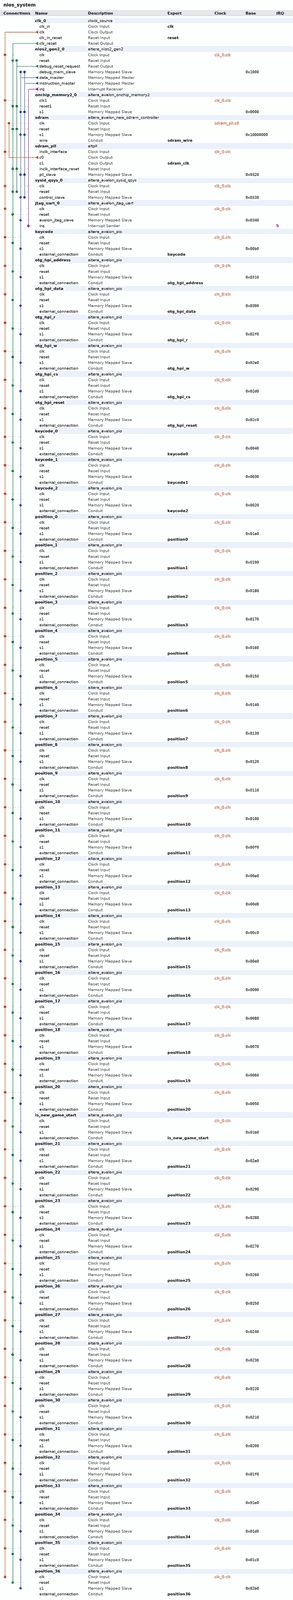
[diagram p0: system contents, whole]
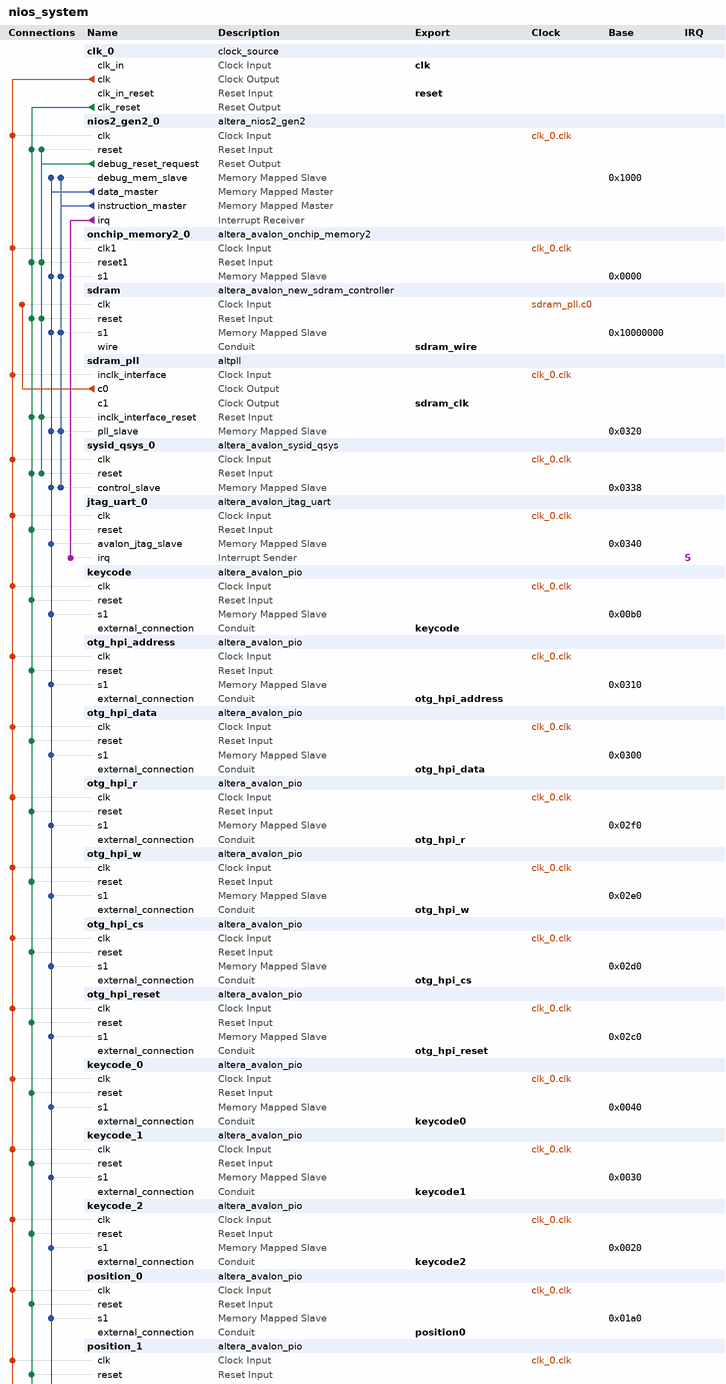
[diagram p1: system contents, upper part]
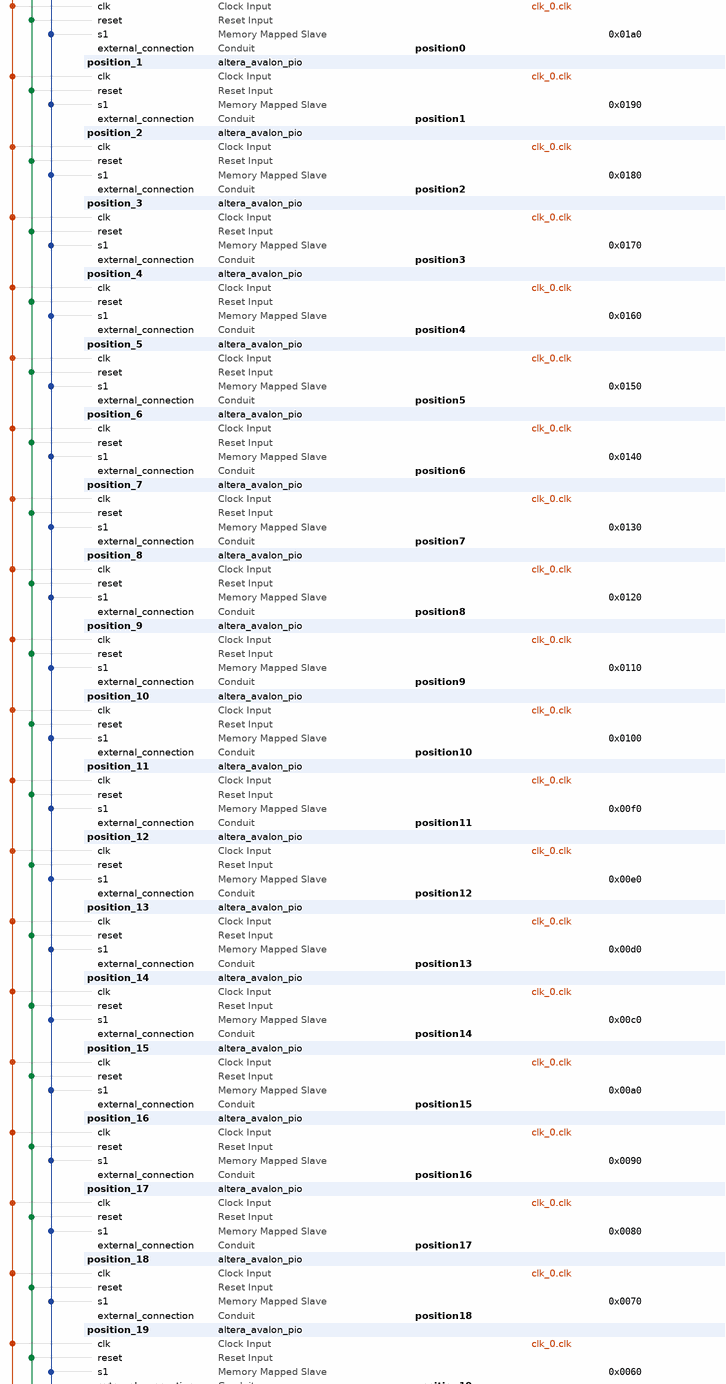
[diagram p2: system contents, middle part]
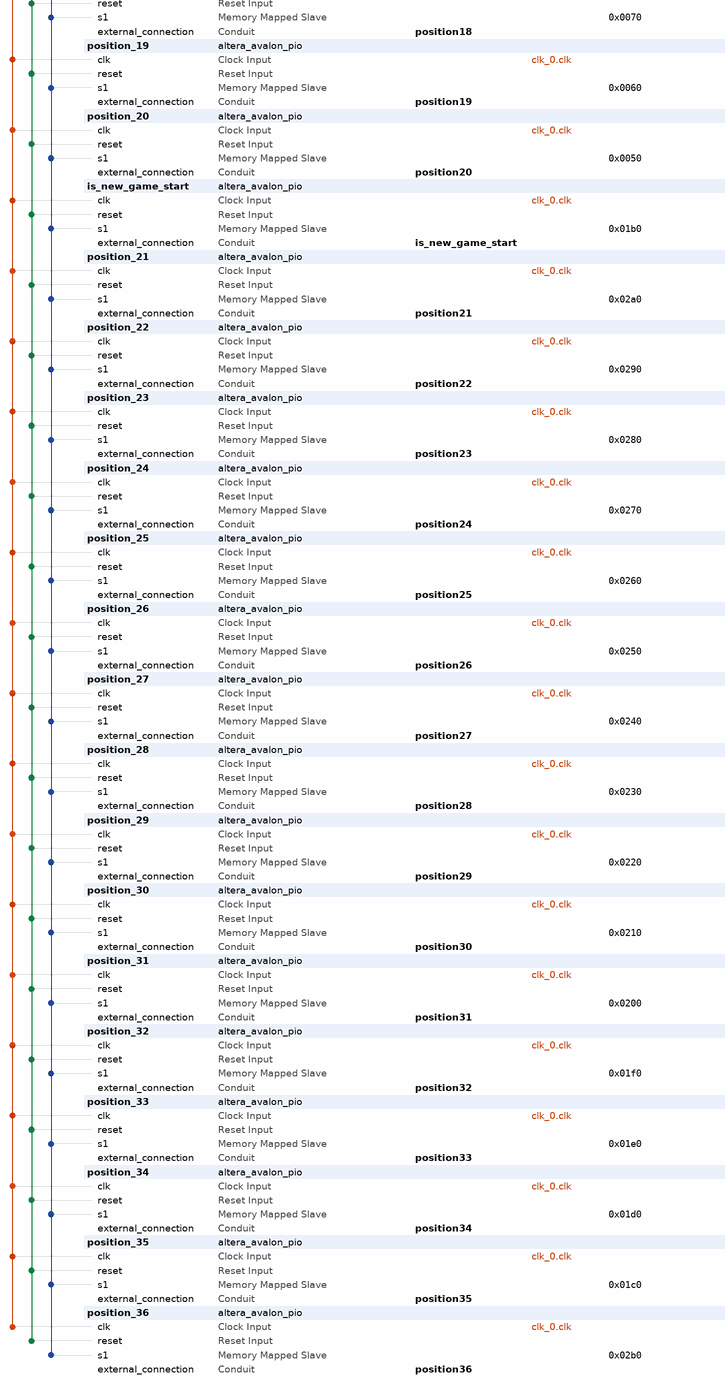
[diagram p3: system contents, lower part]
# Platform Designer (Qsys) system nios_system, Cyclone IV E EP4CE115F29C7
# Parameters at their usual value, and those the tool derives, are not listed.
package require -exact qsys 18.0
create_system nios_system
set_project_property DEVICE_FAMILY {Cyclone IV E}
set_project_property DEVICE EP4CE115F29C7

add_instance clk_0 clock_source 18.0
set_instance_parameter_value clk_0 clockFrequency 50000000

add_instance nios2_gen2_0 altera_nios2_gen2 18.0
set_instance_parameter_value nios2_gen2_0 dcache_size 2048
set_instance_parameter_value nios2_gen2_0 exceptionSlave sdram.s1
set_instance_parameter_value nios2_gen2_0 icache_size 4096
set_instance_parameter_value nios2_gen2_0 impl Tiny
set_instance_parameter_value nios2_gen2_0 resetSlave sdram.s1

add_instance onchip_memory2_0 altera_avalon_onchip_memory2 18.0
set_instance_parameter_value onchip_memory2_0 dataWidth 32
set_instance_parameter_value onchip_memory2_0 dualPort false
set_instance_parameter_value onchip_memory2_0 initMemContent true
set_instance_parameter_value onchip_memory2_0 initializationFileName onchip_mem.hex
set_instance_parameter_value onchip_memory2_0 memorySize 16

add_instance sdram altera_avalon_new_sdram_controller 18.0
set_instance_parameter_value sdram TAC 5.5
set_instance_parameter_value sdram TRCD 20.0
set_instance_parameter_value sdram TRP 20.0
set_instance_parameter_value sdram casLatency 3
set_instance_parameter_value sdram columnWidth 10
set_instance_parameter_value sdram dataWidth 32
set_instance_parameter_value sdram generateSimulationModel false
set_instance_parameter_value sdram model single_Micron_MT48LC4M32B2_7_chip
set_instance_parameter_value sdram numberOfBanks 4
set_instance_parameter_value sdram numberOfChipSelects 1
set_instance_parameter_value sdram powerUpDelay 200.0
set_instance_parameter_value sdram refreshPeriod 7.8125
set_instance_parameter_value sdram rowWidth 13

add_instance sdram_pll altpll 18.0
set_instance_parameter_value sdram_pll CLK0_DIVIDE_BY 1
set_instance_parameter_value sdram_pll CLK0_MULTIPLY_BY 1
set_instance_parameter_value sdram_pll CLK1_DIVIDE_BY 1
set_instance_parameter_value sdram_pll CLK1_DUTY_CYCLE 50
set_instance_parameter_value sdram_pll CLK1_MULTIPLY_BY 1
set_instance_parameter_value sdram_pll CLK1_PHASE_SHIFT -3000
set_instance_parameter_value sdram_pll INCLK0_INPUT_FREQUENCY 20000
set_instance_parameter_value sdram_pll PORT_ARESET PORT_UNUSED
set_instance_parameter_value sdram_pll PORT_LOCKED PORT_UNUSED
set_instance_parameter_value sdram_pll PORT_clk1 PORT_USED
set_instance_parameter_value sdram_pll PORT_clk2 PORT_UNUSED
set_instance_parameter_value sdram_pll PORT_clk3 PORT_UNUSED

add_instance sysid_qsys_0 altera_avalon_sysid_qsys 18.0
set_instance_parameter_value sysid_qsys_0 id 0

add_instance jtag_uart_0 altera_avalon_jtag_uart 18.0
set_instance_parameter_value jtag_uart_0 simInteractiveOptions NO_INTERACTIVE_WINDOWS

add_instance keycode altera_avalon_pio 18.0
set_instance_parameter_value keycode direction Output
set_instance_parameter_value keycode width 32

add_instance otg_hpi_address altera_avalon_pio 18.0
set_instance_parameter_value otg_hpi_address direction Output
set_instance_parameter_value otg_hpi_address width 2

add_instance otg_hpi_data altera_avalon_pio 18.0
set_instance_parameter_value otg_hpi_data direction InOut
set_instance_parameter_value otg_hpi_data width 16

add_instance otg_hpi_r altera_avalon_pio 18.0
set_instance_parameter_value otg_hpi_r direction Output
set_instance_parameter_value otg_hpi_r width 1

add_instance otg_hpi_w altera_avalon_pio 18.0
set_instance_parameter_value otg_hpi_w direction Output
set_instance_parameter_value otg_hpi_w width 1

add_instance otg_hpi_cs altera_avalon_pio 18.0
set_instance_parameter_value otg_hpi_cs direction Output
set_instance_parameter_value otg_hpi_cs width 1

add_instance otg_hpi_reset altera_avalon_pio 18.0
set_instance_parameter_value otg_hpi_reset direction Output
set_instance_parameter_value otg_hpi_reset width 1

add_instance keycode_0 altera_avalon_pio 18.0
set_instance_parameter_value keycode_0 direction Output
set_instance_parameter_value keycode_0 width 32

add_instance keycode_1 altera_avalon_pio 18.0
set_instance_parameter_value keycode_1 direction Output
set_instance_parameter_value keycode_1 width 32

add_instance keycode_2 altera_avalon_pio 18.0
set_instance_parameter_value keycode_2 direction Output
set_instance_parameter_value keycode_2 width 32

add_instance position_0 altera_avalon_pio 18.0
set_instance_parameter_value position_0 direction Output
set_instance_parameter_value position_0 width 32

add_instance position_1 altera_avalon_pio 18.0
set_instance_parameter_value position_1 direction Output
set_instance_parameter_value position_1 width 32

add_instance position_2 altera_avalon_pio 18.0
set_instance_parameter_value position_2 direction Output
set_instance_parameter_value position_2 width 32

add_instance position_3 altera_avalon_pio 18.0
set_instance_parameter_value position_3 direction Output
set_instance_parameter_value position_3 width 32

add_instance position_4 altera_avalon_pio 18.0
set_instance_parameter_value position_4 direction Output
set_instance_parameter_value position_4 width 32

add_instance position_5 altera_avalon_pio 18.0
set_instance_parameter_value position_5 direction Output
set_instance_parameter_value position_5 width 32

add_instance position_6 altera_avalon_pio 18.0
set_instance_parameter_value position_6 direction Output
set_instance_parameter_value position_6 width 32

add_instance position_7 altera_avalon_pio 18.0
set_instance_parameter_value position_7 direction Output
set_instance_parameter_value position_7 width 32

add_instance position_8 altera_avalon_pio 18.0
set_instance_parameter_value position_8 direction Output
set_instance_parameter_value position_8 width 32

add_instance position_9 altera_avalon_pio 18.0
set_instance_parameter_value position_9 direction Output
set_instance_parameter_value position_9 width 32

add_instance position_10 altera_avalon_pio 18.0
set_instance_parameter_value position_10 direction Output
set_instance_parameter_value position_10 width 32

add_instance position_11 altera_avalon_pio 18.0
set_instance_parameter_value position_11 direction Output
set_instance_parameter_value position_11 width 32

add_instance position_12 altera_avalon_pio 18.0
set_instance_parameter_value position_12 direction Output
set_instance_parameter_value position_12 width 32

add_instance position_13 altera_avalon_pio 18.0
set_instance_parameter_value position_13 direction Output
set_instance_parameter_value position_13 width 32

add_instance position_14 altera_avalon_pio 18.0
set_instance_parameter_value position_14 direction Output
set_instance_parameter_value position_14 width 32

add_instance position_15 altera_avalon_pio 18.0
set_instance_parameter_value position_15 direction Output
set_instance_parameter_value position_15 width 32

add_instance position_16 altera_avalon_pio 18.0
set_instance_parameter_value position_16 direction Output
set_instance_parameter_value position_16 width 32

add_instance position_17 altera_avalon_pio 18.0
set_instance_parameter_value position_17 direction Output
set_instance_parameter_value position_17 width 32

add_instance position_18 altera_avalon_pio 18.0
set_instance_parameter_value position_18 direction Output
set_instance_parameter_value position_18 width 32

add_instance position_19 altera_avalon_pio 18.0
set_instance_parameter_value position_19 direction Output
set_instance_parameter_value position_19 width 32

add_instance position_20 altera_avalon_pio 18.0
set_instance_parameter_value position_20 direction Output
set_instance_parameter_value position_20 width 32

add_instance is_new_game_start altera_avalon_pio 18.0
set_instance_parameter_value is_new_game_start direction Input
set_instance_parameter_value is_new_game_start width 32

add_instance position_21 altera_avalon_pio 18.0
set_instance_parameter_value position_21 direction Output
set_instance_parameter_value position_21 width 32

add_instance position_22 altera_avalon_pio 18.0
set_instance_parameter_value position_22 direction Output
set_instance_parameter_value position_22 width 32

add_instance position_23 altera_avalon_pio 18.0
set_instance_parameter_value position_23 direction Output
set_instance_parameter_value position_23 width 32

add_instance position_24 altera_avalon_pio 18.0
set_instance_parameter_value position_24 direction Output
set_instance_parameter_value position_24 width 32

add_instance position_25 altera_avalon_pio 18.0
set_instance_parameter_value position_25 direction Output
set_instance_parameter_value position_25 width 32

add_instance position_26 altera_avalon_pio 18.0
set_instance_parameter_value position_26 direction Output
set_instance_parameter_value position_26 width 32

add_instance position_27 altera_avalon_pio 18.0
set_instance_parameter_value position_27 direction Output
set_instance_parameter_value position_27 width 32

add_instance position_28 altera_avalon_pio 18.0
set_instance_parameter_value position_28 direction Output
set_instance_parameter_value position_28 width 32

add_instance position_29 altera_avalon_pio 18.0
set_instance_parameter_value position_29 direction Output
set_instance_parameter_value position_29 width 32

add_instance position_30 altera_avalon_pio 18.0
set_instance_parameter_value position_30 direction Output
set_instance_parameter_value position_30 width 32

add_instance position_31 altera_avalon_pio 18.0
set_instance_parameter_value position_31 direction Output
set_instance_parameter_value position_31 width 32

add_instance position_32 altera_avalon_pio 18.0
set_instance_parameter_value position_32 direction Output
set_instance_parameter_value position_32 width 32

add_instance position_33 altera_avalon_pio 18.0
set_instance_parameter_value position_33 direction Output
set_instance_parameter_value position_33 width 32

add_instance position_34 altera_avalon_pio 18.0
set_instance_parameter_value position_34 direction Output
set_instance_parameter_value position_34 width 32

add_instance position_35 altera_avalon_pio 18.0
set_instance_parameter_value position_35 direction Output
set_instance_parameter_value position_35 width 32

add_instance position_36 altera_avalon_pio 18.0
set_instance_parameter_value position_36 direction Output
set_instance_parameter_value position_36 width 32

# connections
add_connection clk_0.clk is_new_game_start.clk clock
add_connection clk_0.clk jtag_uart_0.clk clock
add_connection clk_0.clk keycode.clk clock
add_connection clk_0.clk keycode_0.clk clock
add_connection clk_0.clk keycode_1.clk clock
add_connection clk_0.clk keycode_2.clk clock
add_connection clk_0.clk nios2_gen2_0.clk clock
add_connection clk_0.clk onchip_memory2_0.clk1 clock
add_connection clk_0.clk otg_hpi_address.clk clock
add_connection clk_0.clk otg_hpi_cs.clk clock
add_connection clk_0.clk otg_hpi_data.clk clock
add_connection clk_0.clk otg_hpi_r.clk clock
add_connection clk_0.clk otg_hpi_reset.clk clock
add_connection clk_0.clk otg_hpi_w.clk clock
add_connection clk_0.clk position_0.clk clock
add_connection clk_0.clk position_1.clk clock
add_connection clk_0.clk position_2.clk clock
add_connection clk_0.clk position_3.clk clock
add_connection clk_0.clk position_4.clk clock
add_connection clk_0.clk position_5.clk clock
add_connection clk_0.clk position_6.clk clock
add_connection clk_0.clk position_7.clk clock
add_connection clk_0.clk position_8.clk clock
add_connection clk_0.clk position_9.clk clock
add_connection clk_0.clk position_10.clk clock
add_connection clk_0.clk position_11.clk clock
add_connection clk_0.clk position_12.clk clock
add_connection clk_0.clk position_13.clk clock
add_connection clk_0.clk position_14.clk clock
add_connection clk_0.clk position_15.clk clock
add_connection clk_0.clk position_16.clk clock
add_connection clk_0.clk position_17.clk clock
add_connection clk_0.clk position_18.clk clock
add_connection clk_0.clk position_19.clk clock
add_connection clk_0.clk position_20.clk clock
add_connection clk_0.clk position_21.clk clock
add_connection clk_0.clk position_22.clk clock
add_connection clk_0.clk position_23.clk clock
add_connection clk_0.clk position_24.clk clock
add_connection clk_0.clk position_25.clk clock
add_connection clk_0.clk position_26.clk clock
add_connection clk_0.clk position_27.clk clock
add_connection clk_0.clk position_28.clk clock
add_connection clk_0.clk position_29.clk clock
add_connection clk_0.clk position_30.clk clock
add_connection clk_0.clk position_31.clk clock
add_connection clk_0.clk position_32.clk clock
add_connection clk_0.clk position_33.clk clock
add_connection clk_0.clk position_34.clk clock
add_connection clk_0.clk position_35.clk clock
add_connection clk_0.clk position_36.clk clock
add_connection clk_0.clk sdram_pll.inclk_interface clock
add_connection clk_0.clk sysid_qsys_0.clk clock
add_connection sdram_pll.c0 sdram.clk clock
add_connection clk_0.clk_reset is_new_game_start.reset reset
add_connection clk_0.clk_reset jtag_uart_0.reset reset
add_connection clk_0.clk_reset keycode.reset reset
add_connection clk_0.clk_reset keycode_0.reset reset
add_connection clk_0.clk_reset keycode_1.reset reset
add_connection clk_0.clk_reset keycode_2.reset reset
add_connection clk_0.clk_reset nios2_gen2_0.reset reset
add_connection clk_0.clk_reset onchip_memory2_0.reset1 reset
add_connection clk_0.clk_reset otg_hpi_address.reset reset
add_connection clk_0.clk_reset otg_hpi_cs.reset reset
add_connection clk_0.clk_reset otg_hpi_data.reset reset
add_connection clk_0.clk_reset otg_hpi_r.reset reset
add_connection clk_0.clk_reset otg_hpi_reset.reset reset
add_connection clk_0.clk_reset otg_hpi_w.reset reset
add_connection clk_0.clk_reset position_0.reset reset
add_connection clk_0.clk_reset position_1.reset reset
add_connection clk_0.clk_reset position_2.reset reset
add_connection clk_0.clk_reset position_3.reset reset
add_connection clk_0.clk_reset position_4.reset reset
add_connection clk_0.clk_reset position_5.reset reset
add_connection clk_0.clk_reset position_6.reset reset
add_connection clk_0.clk_reset position_7.reset reset
add_connection clk_0.clk_reset position_8.reset reset
add_connection clk_0.clk_reset position_9.reset reset
add_connection clk_0.clk_reset position_10.reset reset
add_connection clk_0.clk_reset position_11.reset reset
add_connection clk_0.clk_reset position_12.reset reset
add_connection clk_0.clk_reset position_13.reset reset
add_connection clk_0.clk_reset position_14.reset reset
add_connection clk_0.clk_reset position_15.reset reset
add_connection clk_0.clk_reset position_16.reset reset
add_connection clk_0.clk_reset position_17.reset reset
add_connection clk_0.clk_reset position_18.reset reset
add_connection clk_0.clk_reset position_19.reset reset
add_connection clk_0.clk_reset position_20.reset reset
add_connection clk_0.clk_reset position_21.reset reset
add_connection clk_0.clk_reset position_22.reset reset
add_connection clk_0.clk_reset position_23.reset reset
add_connection clk_0.clk_reset position_24.reset reset
add_connection clk_0.clk_reset position_25.reset reset
add_connection clk_0.clk_reset position_26.reset reset
add_connection clk_0.clk_reset position_27.reset reset
add_connection clk_0.clk_reset position_28.reset reset
add_connection clk_0.clk_reset position_29.reset reset
add_connection clk_0.clk_reset position_30.reset reset
add_connection clk_0.clk_reset position_31.reset reset
add_connection clk_0.clk_reset position_32.reset reset
add_connection clk_0.clk_reset position_33.reset reset
add_connection clk_0.clk_reset position_34.reset reset
add_connection clk_0.clk_reset position_35.reset reset
add_connection clk_0.clk_reset position_36.reset reset
add_connection clk_0.clk_reset sdram.reset reset
add_connection clk_0.clk_reset sdram_pll.inclk_interface_reset reset
add_connection clk_0.clk_reset sysid_qsys_0.reset reset
add_connection nios2_gen2_0.debug_reset_request nios2_gen2_0.reset reset
add_connection nios2_gen2_0.debug_reset_request onchip_memory2_0.reset1 reset
add_connection nios2_gen2_0.debug_reset_request sdram.reset reset
add_connection nios2_gen2_0.debug_reset_request sdram_pll.inclk_interface_reset reset
add_connection nios2_gen2_0.debug_reset_request sysid_qsys_0.reset reset
add_connection nios2_gen2_0.data_master is_new_game_start.s1 avalon
set_connection_parameter_value nios2_gen2_0.data_master/is_new_game_start.s1 baseAddress 0x01b0
add_connection nios2_gen2_0.data_master jtag_uart_0.avalon_jtag_slave avalon
set_connection_parameter_value nios2_gen2_0.data_master/jtag_uart_0.avalon_jtag_slave baseAddress 0x0340
add_connection nios2_gen2_0.data_master keycode.s1 avalon
set_connection_parameter_value nios2_gen2_0.data_master/keycode.s1 baseAddress 0x00b0
add_connection nios2_gen2_0.data_master keycode_0.s1 avalon
set_connection_parameter_value nios2_gen2_0.data_master/keycode_0.s1 baseAddress 0x0040
add_connection nios2_gen2_0.data_master keycode_1.s1 avalon
set_connection_parameter_value nios2_gen2_0.data_master/keycode_1.s1 baseAddress 0x0030
add_connection nios2_gen2_0.data_master keycode_2.s1 avalon
set_connection_parameter_value nios2_gen2_0.data_master/keycode_2.s1 baseAddress 0x0020
add_connection nios2_gen2_0.data_master nios2_gen2_0.debug_mem_slave avalon
set_connection_parameter_value nios2_gen2_0.data_master/nios2_gen2_0.debug_mem_slave baseAddress 0x1000
add_connection nios2_gen2_0.data_master onchip_memory2_0.s1 avalon
set_connection_parameter_value nios2_gen2_0.data_master/onchip_memory2_0.s1 baseAddress 0x0000
add_connection nios2_gen2_0.data_master otg_hpi_address.s1 avalon
set_connection_parameter_value nios2_gen2_0.data_master/otg_hpi_address.s1 baseAddress 0x0310
add_connection nios2_gen2_0.data_master otg_hpi_cs.s1 avalon
set_connection_parameter_value nios2_gen2_0.data_master/otg_hpi_cs.s1 baseAddress 0x02d0
add_connection nios2_gen2_0.data_master otg_hpi_data.s1 avalon
set_connection_parameter_value nios2_gen2_0.data_master/otg_hpi_data.s1 baseAddress 0x0300
add_connection nios2_gen2_0.data_master otg_hpi_r.s1 avalon
set_connection_parameter_value nios2_gen2_0.data_master/otg_hpi_r.s1 baseAddress 0x02f0
add_connection nios2_gen2_0.data_master otg_hpi_reset.s1 avalon
set_connection_parameter_value nios2_gen2_0.data_master/otg_hpi_reset.s1 baseAddress 0x02c0
add_connection nios2_gen2_0.data_master otg_hpi_w.s1 avalon
set_connection_parameter_value nios2_gen2_0.data_master/otg_hpi_w.s1 baseAddress 0x02e0
add_connection nios2_gen2_0.data_master position_0.s1 avalon
set_connection_parameter_value nios2_gen2_0.data_master/position_0.s1 baseAddress 0x01a0
add_connection nios2_gen2_0.data_master position_1.s1 avalon
set_connection_parameter_value nios2_gen2_0.data_master/position_1.s1 baseAddress 0x0190
add_connection nios2_gen2_0.data_master position_2.s1 avalon
set_connection_parameter_value nios2_gen2_0.data_master/position_2.s1 baseAddress 0x0180
add_connection nios2_gen2_0.data_master position_3.s1 avalon
set_connection_parameter_value nios2_gen2_0.data_master/position_3.s1 baseAddress 0x0170
add_connection nios2_gen2_0.data_master position_4.s1 avalon
set_connection_parameter_value nios2_gen2_0.data_master/position_4.s1 baseAddress 0x0160
add_connection nios2_gen2_0.data_master position_5.s1 avalon
set_connection_parameter_value nios2_gen2_0.data_master/position_5.s1 baseAddress 0x0150
add_connection nios2_gen2_0.data_master position_6.s1 avalon
set_connection_parameter_value nios2_gen2_0.data_master/position_6.s1 baseAddress 0x0140
add_connection nios2_gen2_0.data_master position_7.s1 avalon
set_connection_parameter_value nios2_gen2_0.data_master/position_7.s1 baseAddress 0x0130
add_connection nios2_gen2_0.data_master position_8.s1 avalon
set_connection_parameter_value nios2_gen2_0.data_master/position_8.s1 baseAddress 0x0120
add_connection nios2_gen2_0.data_master position_9.s1 avalon
set_connection_parameter_value nios2_gen2_0.data_master/position_9.s1 baseAddress 0x0110
add_connection nios2_gen2_0.data_master position_10.s1 avalon
set_connection_parameter_value nios2_gen2_0.data_master/position_10.s1 baseAddress 0x0100
add_connection nios2_gen2_0.data_master position_11.s1 avalon
set_connection_parameter_value nios2_gen2_0.data_master/position_11.s1 baseAddress 0x00f0
add_connection nios2_gen2_0.data_master position_12.s1 avalon
set_connection_parameter_value nios2_gen2_0.data_master/position_12.s1 baseAddress 0x00e0
add_connection nios2_gen2_0.data_master position_13.s1 avalon
set_connection_parameter_value nios2_gen2_0.data_master/position_13.s1 baseAddress 0x00d0
add_connection nios2_gen2_0.data_master position_14.s1 avalon
set_connection_parameter_value nios2_gen2_0.data_master/position_14.s1 baseAddress 0x00c0
add_connection nios2_gen2_0.data_master position_15.s1 avalon
set_connection_parameter_value nios2_gen2_0.data_master/position_15.s1 baseAddress 0x00a0
add_connection nios2_gen2_0.data_master position_16.s1 avalon
set_connection_parameter_value nios2_gen2_0.data_master/position_16.s1 baseAddress 0x0090
add_connection nios2_gen2_0.data_master position_17.s1 avalon
set_connection_parameter_value nios2_gen2_0.data_master/position_17.s1 baseAddress 0x0080
add_connection nios2_gen2_0.data_master position_18.s1 avalon
set_connection_parameter_value nios2_gen2_0.data_master/position_18.s1 baseAddress 0x0070
add_connection nios2_gen2_0.data_master position_19.s1 avalon
set_connection_parameter_value nios2_gen2_0.data_master/position_19.s1 baseAddress 0x0060
add_connection nios2_gen2_0.data_master position_20.s1 avalon
set_connection_parameter_value nios2_gen2_0.data_master/position_20.s1 baseAddress 0x0050
add_connection nios2_gen2_0.data_master position_21.s1 avalon
set_connection_parameter_value nios2_gen2_0.data_master/position_21.s1 baseAddress 0x02a0
add_connection nios2_gen2_0.data_master position_22.s1 avalon
set_connection_parameter_value nios2_gen2_0.data_master/position_22.s1 baseAddress 0x0290
add_connection nios2_gen2_0.data_master position_23.s1 avalon
set_connection_parameter_value nios2_gen2_0.data_master/position_23.s1 baseAddress 0x0280
add_connection nios2_gen2_0.data_master position_24.s1 avalon
set_connection_parameter_value nios2_gen2_0.data_master/position_24.s1 baseAddress 0x0270
add_connection nios2_gen2_0.data_master position_25.s1 avalon
set_connection_parameter_value nios2_gen2_0.data_master/position_25.s1 baseAddress 0x0260
add_connection nios2_gen2_0.data_master position_26.s1 avalon
set_connection_parameter_value nios2_gen2_0.data_master/position_26.s1 baseAddress 0x0250
add_connection nios2_gen2_0.data_master position_27.s1 avalon
set_connection_parameter_value nios2_gen2_0.data_master/position_27.s1 baseAddress 0x0240
add_connection nios2_gen2_0.data_master position_28.s1 avalon
set_connection_parameter_value nios2_gen2_0.data_master/position_28.s1 baseAddress 0x0230
add_connection nios2_gen2_0.data_master position_29.s1 avalon
set_connection_parameter_value nios2_gen2_0.data_master/position_29.s1 baseAddress 0x0220
add_connection nios2_gen2_0.data_master position_30.s1 avalon
set_connection_parameter_value nios2_gen2_0.data_master/position_30.s1 baseAddress 0x0210
add_connection nios2_gen2_0.data_master position_31.s1 avalon
set_connection_parameter_value nios2_gen2_0.data_master/position_31.s1 baseAddress 0x0200
add_connection nios2_gen2_0.data_master position_32.s1 avalon
set_connection_parameter_value nios2_gen2_0.data_master/position_32.s1 baseAddress 0x01f0
add_connection nios2_gen2_0.data_master position_33.s1 avalon
set_connection_parameter_value nios2_gen2_0.data_master/position_33.s1 baseAddress 0x01e0
add_connection nios2_gen2_0.data_master position_34.s1 avalon
set_connection_parameter_value nios2_gen2_0.data_master/position_34.s1 baseAddress 0x01d0
add_connection nios2_gen2_0.data_master position_35.s1 avalon
set_connection_parameter_value nios2_gen2_0.data_master/position_35.s1 baseAddress 0x01c0
add_connection nios2_gen2_0.data_master position_36.s1 avalon
set_connection_parameter_value nios2_gen2_0.data_master/position_36.s1 baseAddress 0x02b0
add_connection nios2_gen2_0.data_master sdram.s1 avalon
set_connection_parameter_value nios2_gen2_0.data_master/sdram.s1 baseAddress 0x10000000
add_connection nios2_gen2_0.data_master sdram_pll.pll_slave avalon
set_connection_parameter_value nios2_gen2_0.data_master/sdram_pll.pll_slave baseAddress 0x0320
add_connection nios2_gen2_0.data_master sysid_qsys_0.control_slave avalon
set_connection_parameter_value nios2_gen2_0.data_master/sysid_qsys_0.control_slave baseAddress 0x0338
add_connection nios2_gen2_0.instruction_master nios2_gen2_0.debug_mem_slave avalon
set_connection_parameter_value nios2_gen2_0.instruction_master/nios2_gen2_0.debug_mem_slave baseAddress 0x1000
add_connection nios2_gen2_0.instruction_master onchip_memory2_0.s1 avalon
set_connection_parameter_value nios2_gen2_0.instruction_master/onchip_memory2_0.s1 baseAddress 0x0000
add_connection nios2_gen2_0.instruction_master sdram.s1 avalon
set_connection_parameter_value nios2_gen2_0.instruction_master/sdram.s1 baseAddress 0x10000000
add_connection nios2_gen2_0.instruction_master sdram_pll.pll_slave avalon
set_connection_parameter_value nios2_gen2_0.instruction_master/sdram_pll.pll_slave baseAddress 0x0320
add_connection nios2_gen2_0.instruction_master sysid_qsys_0.control_slave avalon
set_connection_parameter_value nios2_gen2_0.instruction_master/sysid_qsys_0.control_slave baseAddress 0x0338
add_connection nios2_gen2_0.irq jtag_uart_0.irq interrupt
set_connection_parameter_value nios2_gen2_0.irq/jtag_uart_0.irq irqNumber 5

# exported interfaces
add_interface clk clock sink
set_interface_property clk EXPORT_OF clk_0.clk_in
add_interface is_new_game_start conduit end
set_interface_property is_new_game_start EXPORT_OF is_new_game_start.external_connection
add_interface keycode conduit end
set_interface_property keycode EXPORT_OF keycode.external_connection
add_interface keycode0 conduit end
set_interface_property keycode0 EXPORT_OF keycode_0.external_connection
add_interface keycode1 conduit end
set_interface_property keycode1 EXPORT_OF keycode_1.external_connection
add_interface keycode2 conduit end
set_interface_property keycode2 EXPORT_OF keycode_2.external_connection
add_interface otg_hpi_address conduit end
set_interface_property otg_hpi_address EXPORT_OF otg_hpi_address.external_connection
add_interface otg_hpi_cs conduit end
set_interface_property otg_hpi_cs EXPORT_OF otg_hpi_cs.external_connection
add_interface otg_hpi_data conduit end
set_interface_property otg_hpi_data EXPORT_OF otg_hpi_data.external_connection
add_interface otg_hpi_r conduit end
set_interface_property otg_hpi_r EXPORT_OF otg_hpi_r.external_connection
add_interface otg_hpi_reset conduit end
set_interface_property otg_hpi_reset EXPORT_OF otg_hpi_reset.external_connection
add_interface otg_hpi_w conduit end
set_interface_property otg_hpi_w EXPORT_OF otg_hpi_w.external_connection
add_interface position0 conduit end
set_interface_property position0 EXPORT_OF position_0.external_connection
add_interface position1 conduit end
set_interface_property position1 EXPORT_OF position_1.external_connection
add_interface position10 conduit end
set_interface_property position10 EXPORT_OF position_10.external_connection
add_interface position11 conduit end
set_interface_property position11 EXPORT_OF position_11.external_connection
add_interface position12 conduit end
set_interface_property position12 EXPORT_OF position_12.external_connection
add_interface position13 conduit end
set_interface_property position13 EXPORT_OF position_13.external_connection
add_interface position14 conduit end
set_interface_property position14 EXPORT_OF position_14.external_connection
add_interface position15 conduit end
set_interface_property position15 EXPORT_OF position_15.external_connection
add_interface position16 conduit end
set_interface_property position16 EXPORT_OF position_16.external_connection
add_interface position17 conduit end
set_interface_property position17 EXPORT_OF position_17.external_connection
add_interface position18 conduit end
set_interface_property position18 EXPORT_OF position_18.external_connection
add_interface position19 conduit end
set_interface_property position19 EXPORT_OF position_19.external_connection
add_interface position2 conduit end
set_interface_property position2 EXPORT_OF position_2.external_connection
add_interface position20 conduit end
set_interface_property position20 EXPORT_OF position_20.external_connection
add_interface position21 conduit end
set_interface_property position21 EXPORT_OF position_21.external_connection
add_interface position22 conduit end
set_interface_property position22 EXPORT_OF position_22.external_connection
add_interface position23 conduit end
set_interface_property position23 EXPORT_OF position_23.external_connection
add_interface position24 conduit end
set_interface_property position24 EXPORT_OF position_24.external_connection
add_interface position25 conduit end
set_interface_property position25 EXPORT_OF position_25.external_connection
add_interface position26 conduit end
set_interface_property position26 EXPORT_OF position_26.external_connection
add_interface position27 conduit end
set_interface_property position27 EXPORT_OF position_27.external_connection
add_interface position28 conduit end
set_interface_property position28 EXPORT_OF position_28.external_connection
add_interface position29 conduit end
set_interface_property position29 EXPORT_OF position_29.external_connection
add_interface position3 conduit end
set_interface_property position3 EXPORT_OF position_3.external_connection
add_interface position30 conduit end
set_interface_property position30 EXPORT_OF position_30.external_connection
add_interface position31 conduit end
set_interface_property position31 EXPORT_OF position_31.external_connection
add_interface position32 conduit end
set_interface_property position32 EXPORT_OF position_32.external_connection
add_interface position33 conduit end
set_interface_property position33 EXPORT_OF position_33.external_connection
add_interface position34 conduit end
set_interface_property position34 EXPORT_OF position_34.external_connection
add_interface position35 conduit end
set_interface_property position35 EXPORT_OF position_35.external_connection
add_interface position36 conduit end
set_interface_property position36 EXPORT_OF position_36.external_connection
add_interface position4 conduit end
set_interface_property position4 EXPORT_OF position_4.external_connection
add_interface position5 conduit end
set_interface_property position5 EXPORT_OF position_5.external_connection
add_interface position6 conduit end
set_interface_property position6 EXPORT_OF position_6.external_connection
add_interface position7 conduit end
set_interface_property position7 EXPORT_OF position_7.external_connection
add_interface position8 conduit end
set_interface_property position8 EXPORT_OF position_8.external_connection
add_interface position9 conduit end
set_interface_property position9 EXPORT_OF position_9.external_connection
add_interface reset reset sink
set_interface_property reset EXPORT_OF clk_0.clk_in_reset
add_interface sdram_clk clock source
set_interface_property sdram_clk EXPORT_OF sdram_pll.c1
add_interface sdram_wire conduit end
set_interface_property sdram_wire EXPORT_OF sdram.wire

set_interconnect_requirement {$system} qsys_mm.clockCrossingAdapter HANDSHAKE
set_interconnect_requirement {$system} qsys_mm.enableEccProtection FALSE
set_interconnect_requirement {$system} qsys_mm.insertDefaultSlave FALSE
set_interconnect_requirement {$system} qsys_mm.maxAdditionalLatency 1

save_system nios_system.qsys
